# EAGLE design current_monitor_v1-2-1 (EAGLE 6.5.0)
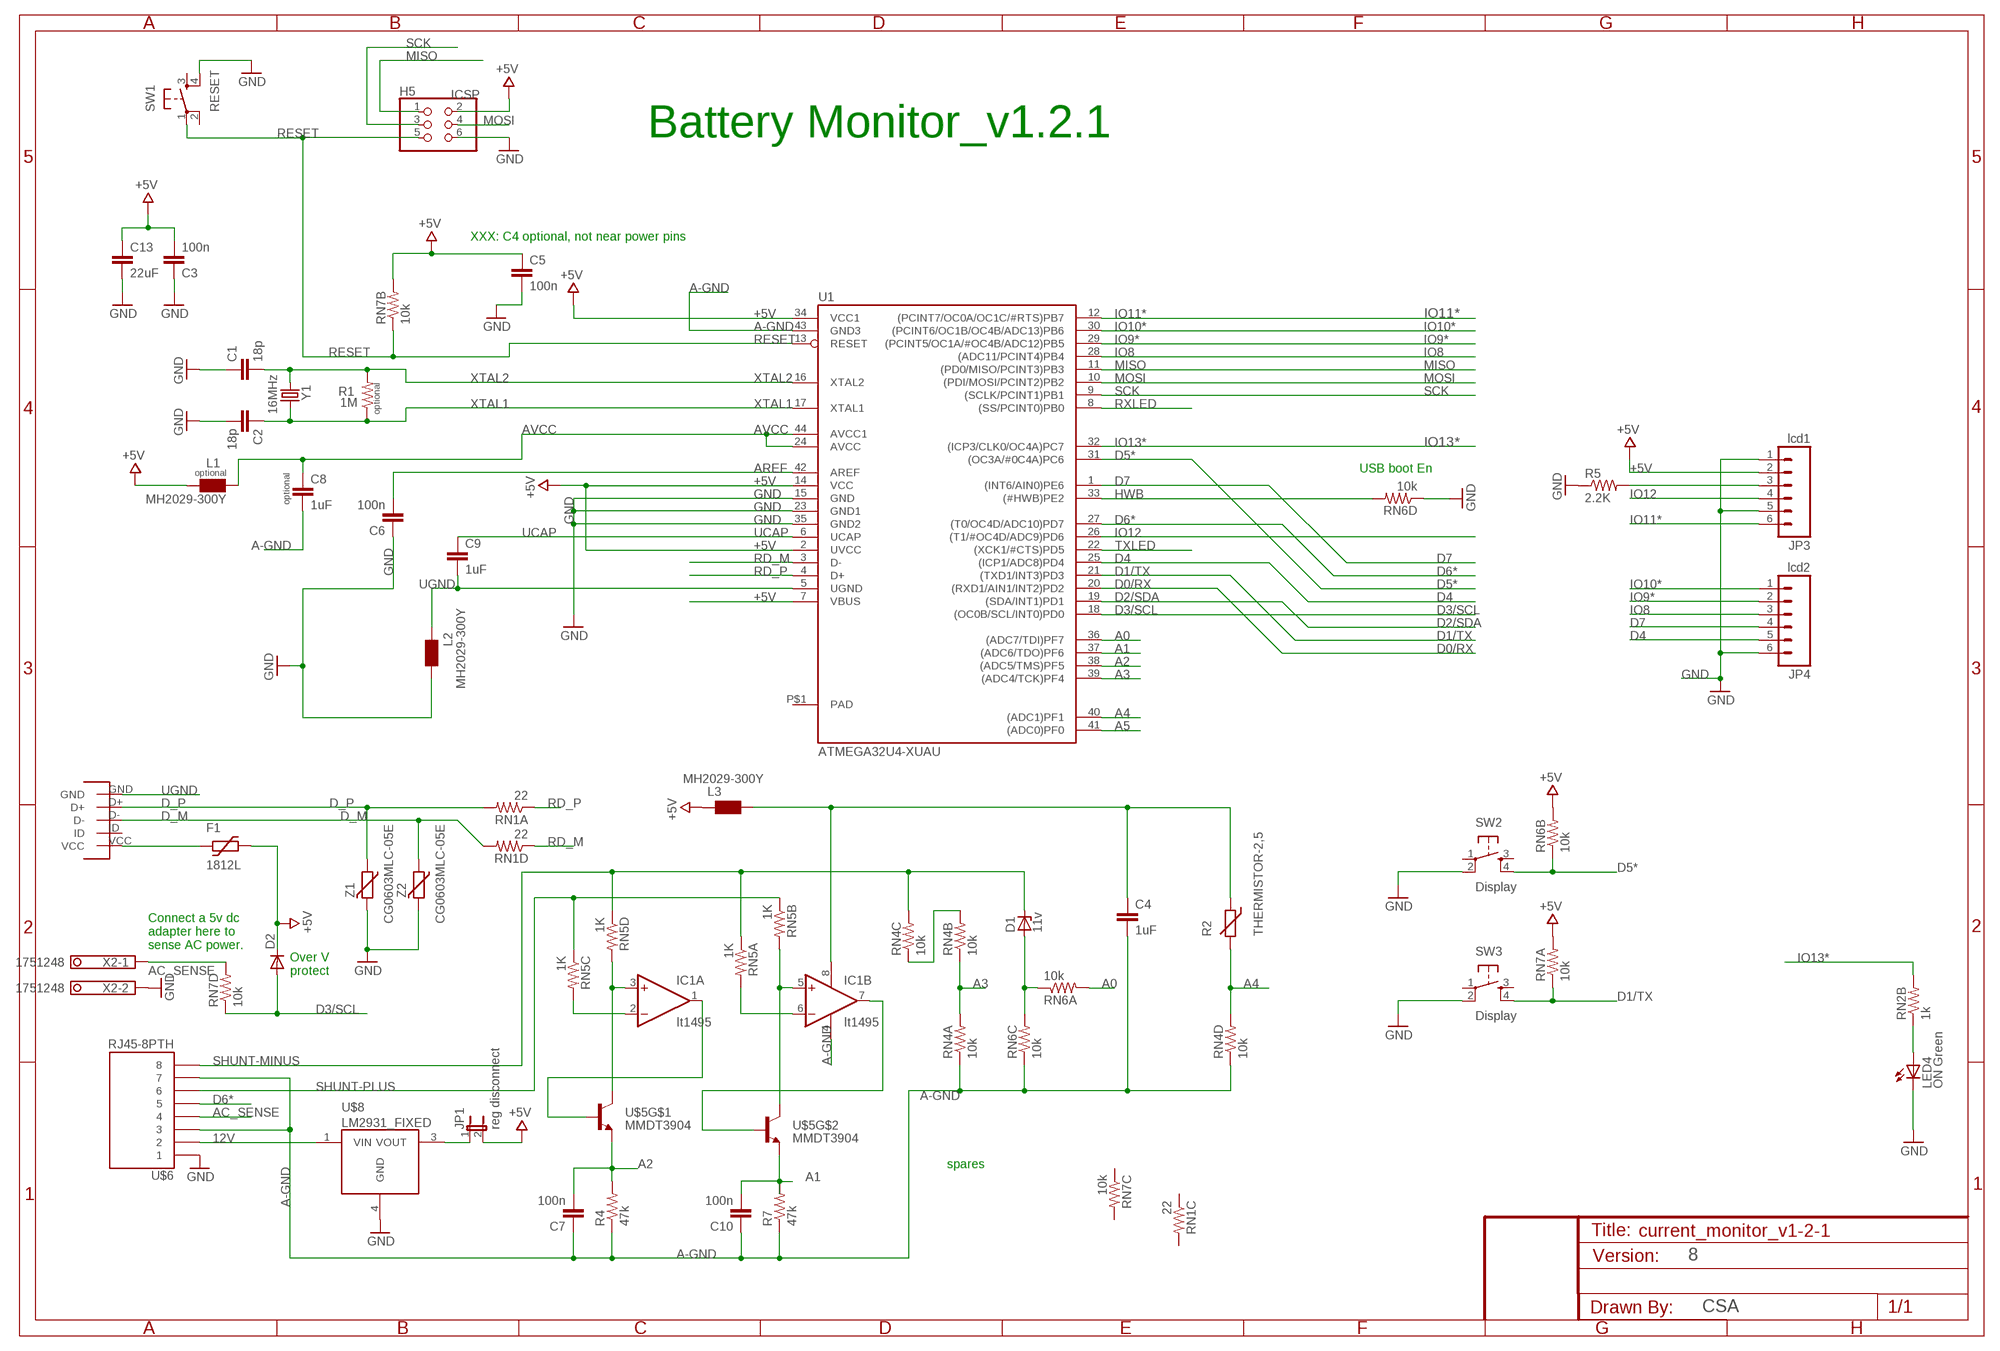
[diagram p0: schematic, sheet 1]

## Parts
C1  18p  CAP0805  [0805]
C2  18p  CAP0805  [0805]
C3  100n  CAP0805  [0805]
C4  1uF  CAP0805  [0805]
C5  100n  CAP0805  [0805]
C6  100n  CAP0805  [0805]
C7  100n  CAP0805  [0805]
C8  1uF  CAP0805  [0805]
C9  1uF  CAP0805  [0805]
C10  100n  CAP0805  [0805]
C13  22uF  CAP1206  [1206]
D1  11v  ZENER-DIODEZD-5  [ZDIO-5]
D2  DIODESMA  [SMA-DIODE]
F1  1812L  [1812L]
H5  ICSP  PINHD-2X3  [2X03]
IC1  lt1495  LM4558D  [SO08]
JP1  reg disconnect  JUMPER-2-OLDPTH_LOCK  [1X02_LOCK]
JP3  lcd1  M06FEMALE_LOCK  [1X06_FEMALE_LOCK.010]
JP4  lcd2  M06FEMALE_LOCK  [1X06_FEMALE_LOCK.010]
L1  MH2029-300Y  WE-CBF_0805  [0805]
L2  MH2029-300Y  WE-CBF_0805  [0805]
L3  MH2029-300Y  WE-CBF_0805  [0805]
LED4  ON Green  LED0805  [LED0805]
R1  1M  RESISTOR0805-RES  [0805]
R2  THERMISTOR-2,5  [RS-2,5]
R4  47k  RESISTOR0805-RES  [0805]
R5  2.2K  RESISTOR0805-RES  [0805]
R7  47k  RESISTOR0805-RES  [0805]
RN1  22  RESISTOR-ARRAYCRA06S  [CRA06S]
RN2  1k  RESISTOR-ARRAYCRA06S  [CRA06S]
RN4  10k  RESISTOR-ARRAYCRA06S  [CRA06S]
RN5  1K  RESISTOR-ARRAYCRA06S  [CRA06S]
RN6  10k  RESISTOR-ARRAYCRA06S  [CRA06S]
RN7  10k  RESISTOR-ARRAYCRA06S  [CRA06S]
SW1  RESET  TAC_SWITCHPTH  [TACTILE-PTH]
SW2  Display  TAC_SWITCHPTH  [TACTILE-PTH]
SW3  Display  TAC_SWITCHPTH  [TACTILE-PTH]
U1  ATMEGA32U4-XUAU  [TQFP44-PAD]
U$5  MMDT3904  [SOT363]
U$6  RJ45-8PTH  [RJ45-8]
U$8  LM2931_FIXED  [DPAK]
U$16  USB-MICRO-B-DIGIKEY  [USB-MICRO-B-DIGIKEY]
X2  1751248  [1751248]
Y1  16MHz  CRYSTALHC49US  [HC49US]
Z1  CG0603MLC-05E  VARISTORCN0603  [CT/CN0603]
Z2  CG0603MLC-05E  VARISTORCN0603  [CT/CN0603]

## Nets
12V: U$6.2 U$8.1(VIN)
+5V [power]: C3.2 C5.1 C13.1 D2.C F1.P$2 H5.2 JP1.2 JP3.2 L1.1 L3.1 RN6.7 RN7.7 RN7.8 U1.2(UVCC) U1.7(VBUS) U1.14(VCC) U1.34(VCC1)
A0: RN6.8 U1.36((ADC7/TDI)PF7)
A1: C10.2 R7.2 U1.37((ADC6/TDO)PF6) U$5.1(E)
A2: C7.2 R4.2 U1.38((ADC5/TMS)PF5) U$5.4(E)
A3: RN4.2 RN4.8 U1.39((ADC4/TCK)PF4)
A4: R2.2 RN4.5 U1.40((ADC1)PF1)
A5: U1.41((ADC0)PF0)
A-GND: C4.2 C7.1 C8.2 C10.1 IC1.4(P:V-) R4.1 R7.1 RN4.1 RN4.4 RN6.3 U1.43(GND3) U$6.3 U$6.7
AC_SENSE: RN7.5 U$6.4 X2.1
AREF [aref]: C6.2 U1.42(AREF)
AVCC: C8.1 L1.2 U1.24(AVCC) U1.44(AVCC1)
D0/RX: U1.20((RXD1/AIN1/INT2)PD2)
D1/TX: RN7.1 SW3.4 U1.21((TXD1/INT3)PD3)
D2/SDA: U1.19((SDA/INT1)PD1)
D3/SCL: D2.A RN7.4 U1.18((OC0B/SCL/INT0)PD0)
D4: JP4.5 U1.25((ICP1/ADC8)PD4)
D5*: RN6.2 SW2.4 U1.31((OC3A/#0C4A)PC6)
D6*: U1.27((T0/OC4D/ADC10)PD7) U$6.5
D7: JP4.4 U1.1((INT6/AIN0)PE6)
D_M: RN1.5 U$16.D- Z2.1
D_P: RN1.8 U$16.D+ Z1.1
GND: C1.1 C2.2 C3.1 C5.2 C6.1 C13.2 H5.6 JP3.1 JP3.5 JP4.6 L2.2 LED4.C R5.1 RN6.4 SW1.4 SW2.2 SW3.2 U1.15(GND) U1.23(GND1) U1.35(GND2) U$6.1 U$8.4(GND) X2.2 Z1.2 Z2.2
HWB: RN6.5 U1.33((#HWB)PE2)
IO8: JP4.3 U1.28((ADC11/PCINT4)PB4)
IO9*: JP4.2 U1.29((PCINT5/OC1A/#OC4B/ADC12)PB5)
IO10*: JP4.1 U1.30((PCINT6/OC1B/OC4B/ADC13)PB6)
IO11*: JP3.6 U1.12((PCINT7/OC0A/OC1C/#RTS)PB7)
IO12: JP3.4 U1.26((T1/#OC4D/ADC9)PD6)
IO13*: RN2.7 U1.32((ICP3/CLK0/OC4A)PC7)
LED4_ANODE: LED4.A RN2.2
MISO: H5.1 U1.11((PD0/MISO/PCINT3)PB3)
MOSI: H5.4 U1.10((PDI/MOSI/PCINT2)PB2)
N$1: IC1.5(B:+IN) RN5.7 U$5.6(C)
N$2: IC1.2(A:-IN) RN5.6
N$3: IC1.6(B:-IN) RN5.8
N$4: IC1.1(A:OUT) U$5.5(B)
N$5: IC1.7(B:OUT) U$5.2(B)
N$6: IC1.3(A:+IN) RN5.5 U$5.3(C)
N$7: F1.P$1 U$16.VCC
N$8: JP1.1 U$8.3(VOUT)
N$10: RN4.3 RN4.7
N$12: JP3.3 R5.2
N$13: D1.A RN6.1 RN6.6
N$15 [power]: C4.1 IC1.8(P:V+) L3.2 R2.1
RD_M: RN1.4 U1.3(D-)
RD_P: RN1.1 U1.4(D+)
RESET: H5.5 RN7.2 SW1.1 U1.13(RESET)
RXLED: U1.8((SS/PCINT0)PB0)
SCK: H5.3 U1.9((SCLK/PCINT1)PB1)
SHUNT-MINUS: D1.C RN4.6 RN5.1 RN5.4 U$6.8
SHUNT-PLUS: RN5.2 RN5.3 U$6.6
TXLED: U1.22((XCK1/#CTS)PD5)
UCAP: C9.1 U1.6(UCAP)
UGND [gnd]: C9.2 L2.1 U1.5(UGND) U$16.GND
XTAL1: C2.1 R1.1 U1.17(XTAL1) Y1.2
XTAL2: C1.2 R1.2 U1.16(XTAL2) Y1.1
Unconnected: RN1.2 RN1.3 RN1.6 RN1.7 RN2.1 RN2.3 RN2.4 RN2.5 RN2.6 RN2.8 RN7.3 RN7.6 SW1.2 SW1.3 SW2.1 SW2.3 SW3.1 SW3.3 U$16.ID

## Notes on the sheet
- Battery Monitor_v1.2.1
- XXX: C4 optional, not near power pins
- optional
- USB boot En
- optional
- optional
- Connect a 5v dc
  adapter here to 
  sense AC power.
- Over V
  protect
- spares
- 8
- CSA

## Power pins joined to a net without a drawn wire
PAD: U1.P$1(PAD)

## Library data of the parts
C1-C10 C13 = SparkFun-Passives:CAP: Capacitor Standard 0603 ceramic capacitor, and 0.1" leaded capacitor.
D1 = diode:ZENER-DIODE: Z-Diode
D2 = SparkFun-DiscreteSemi:DIODE: Diode These are standard reverse protection diodes and small signal diodes. SMA package can handle up to about 1A. SOD-323 can handle about 200mA. What the SOD-323 package when ordering, there are some mfgs out there that are 5-pin packages.
F1 = ptc-littlefuse:1812L
H5 = SmartPrj:PINHD-2X3: PIN HEADER
IC1 = linear:*4558: OP AMP
JP1 = SparkFun-Passives:JUMPER-2-OLD: Jumper Basic 0.1" spaced jumper. Use with breakaway headers.
JP3 JP4 = SparkFun-Connectors:M06: Header 6 Standard 6-pin 0.1" header. Use with straight break away headers (SKU : PRT-00116), right angle break away headers (PRT-00553), swiss pins (PRT-00743), machine pins (PRT-00117), and female headers (PRT-00115). Molex polarized connector foot print use with SKU : PRT-08094 with associated crimp pins and housings. NOTES ON THE VARIANTS LOCK and LOCK_LONGPADS... This footprint was designed to help hold the alignment of a through-hole component (i.e. 6-pin header) while soldering it into place. You may notice that each hole has been shifted either up or down by 0.005 of an inch from it's more standard position (which is a perfectly straight line). This slight alteration caused the pins (the squares in the middle) to touch the edges of the holes. Because they are alternating, it causes a "brace" to hold the component in place. 0.005 has proven to be the perfect amount of "off-center" position when using our standard breakaway headers. Although looks a little odd when you look at the bare footprint, once you have a header in there, the alteration is very hard to notice. Also, if you push a header all the way into place, it is covered up entirely on the bottom side. This idea of altering the position of holes to aid alignment will be further integrated into the Sparkfun Library for other footprints. It can help hold any component with 3 or more connection pins.
L1-L3 = wuerth-elektronik:WE-CBF: SMD EMI Suppression Ferrite Beads - excellent anti-EMI properties - low DCR - impedances till 3000 ohms - rated current up to 6 A
LED4 = xorduino:LED
R1 R4 R5 R7 = SparkFun-Passives:RESISTOR: Resistor Basic schematic elements and footprints for 0603, 1206, and PTH resistors.
R2 = varistor:THERMISTOR: THERMISTOR
RN1 RN2 RN4-RN7 = xorduino:RESISTOR-ARRAY
SW1-SW3 = SparkFun-Electromechanical:TAC_SWITCH: Momentary Switch Button commonly used for reset or general input. Spark Fun Electronics SKU : COM-00097
U1 = SmartPrj:ATMEGA32U4-XU
U$5 = SparkFun-DiscreteSemi:MMDT3904: Dual NPN transistor
U$6 = SparkFun-Connectors:RJ45-8: RJ45 Jack Simple RJ45, 8-pin connection - connector for common Cat5, Cat5e, and Cat6 Ethernet cables. Footprint not yet proven in production. Connector sku is PRT-00643; Breakout PCB sku is BOB-00716.
U$8 = SparkFun-PowerIC:LM2931_FIXED: LDO regulator with reverse battery protection- very durable!
U$16 = gh_stuff:USB-MICRO-B-DIGIKEY
X2 = con-phoenix-350:1751248: MKDS 1/ 2-3,5 Printklemme Nennstrom: 10 A Bemessungsspannung: 160 V Raster: 3,5 mm Polzahl: 2 Montageart: Löten Anschlussart: Schraubanschluss Anschlussrichtung vom Leiter zur Platine: 0° Source: http://eshop.phoenixcontact.com .. 1751248.pdf; OC_FARNELL: unknown; OC_NEWARK: unknown
Y1 = SparkFun-FreqCtrl:CRYSTAL: Various standard crystals. Proven footprints. Spark Fun Electronics SKU : COM-00534
Z1 Z2 = varistor:VARISTOR: VARISTOR

## Net classes
0 default: width 0.203 mm, drill 0.406 mm, clearance 0.205 mm
1 power: width 0.203 mm, drill 0.406 mm, clearance 0.205 mm to class 0, clearance 0.205 mm
2 gnd: width 0.203 mm, drill 0.406 mm, clearance 0.205 mm to class 0, clearance 0.205 mm to class 1, clearance 0.205 mm
3 usbvcc: width 0.203 mm, drill 0.406 mm, clearance 0.203 mm
4 aref: width 0.203 mm, drill 0.406 mm, clearance 0.205 mm to class 0, clearance 0.205 mm to class 1, clearance 0.205 mm to class 2, clearance 0.205 mm to class 3, clearance 0.205 mm

## Board
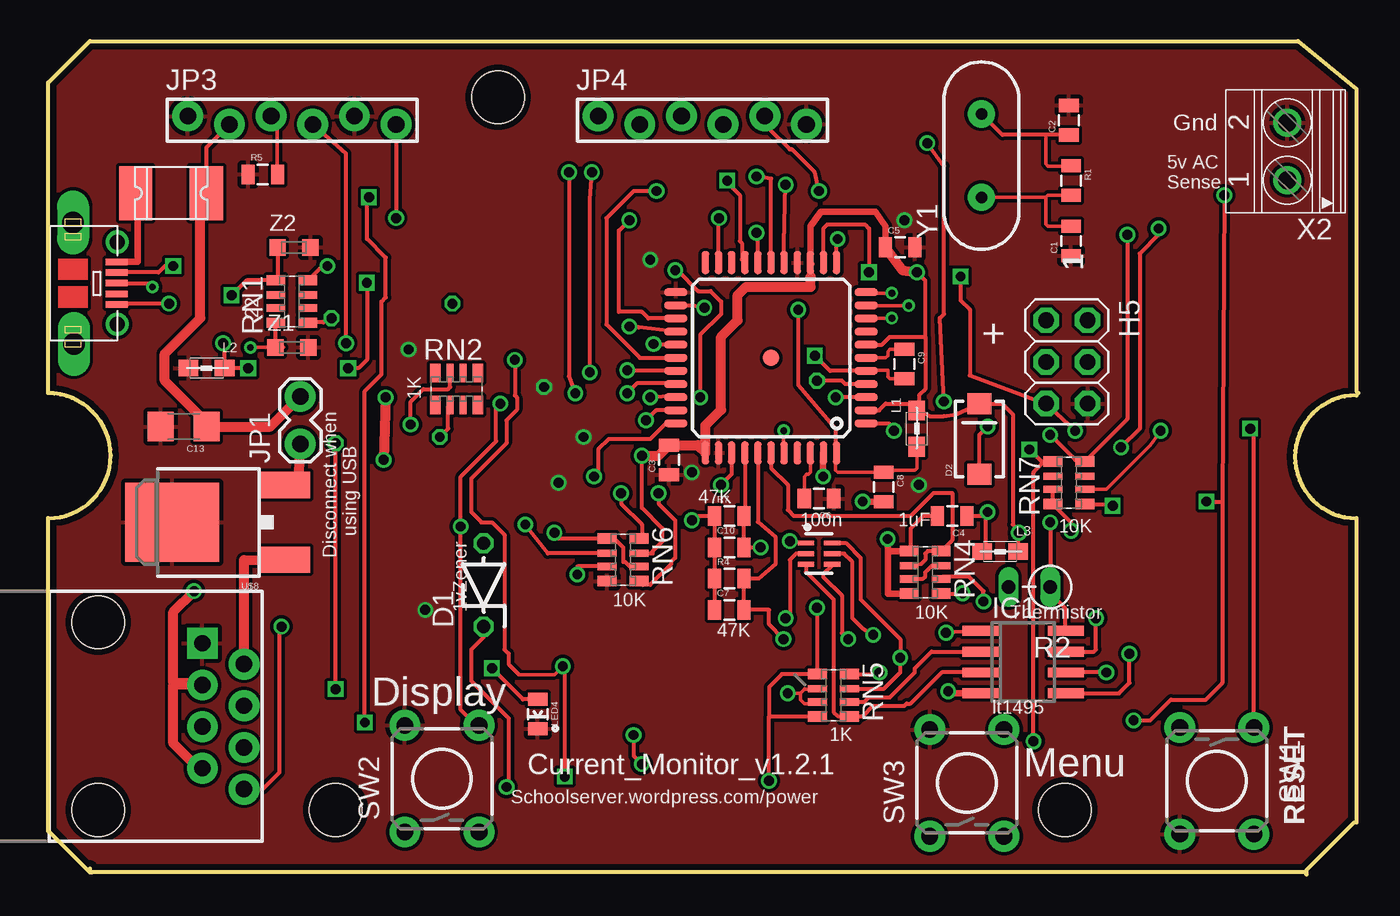
[diagram p1: board, top side]
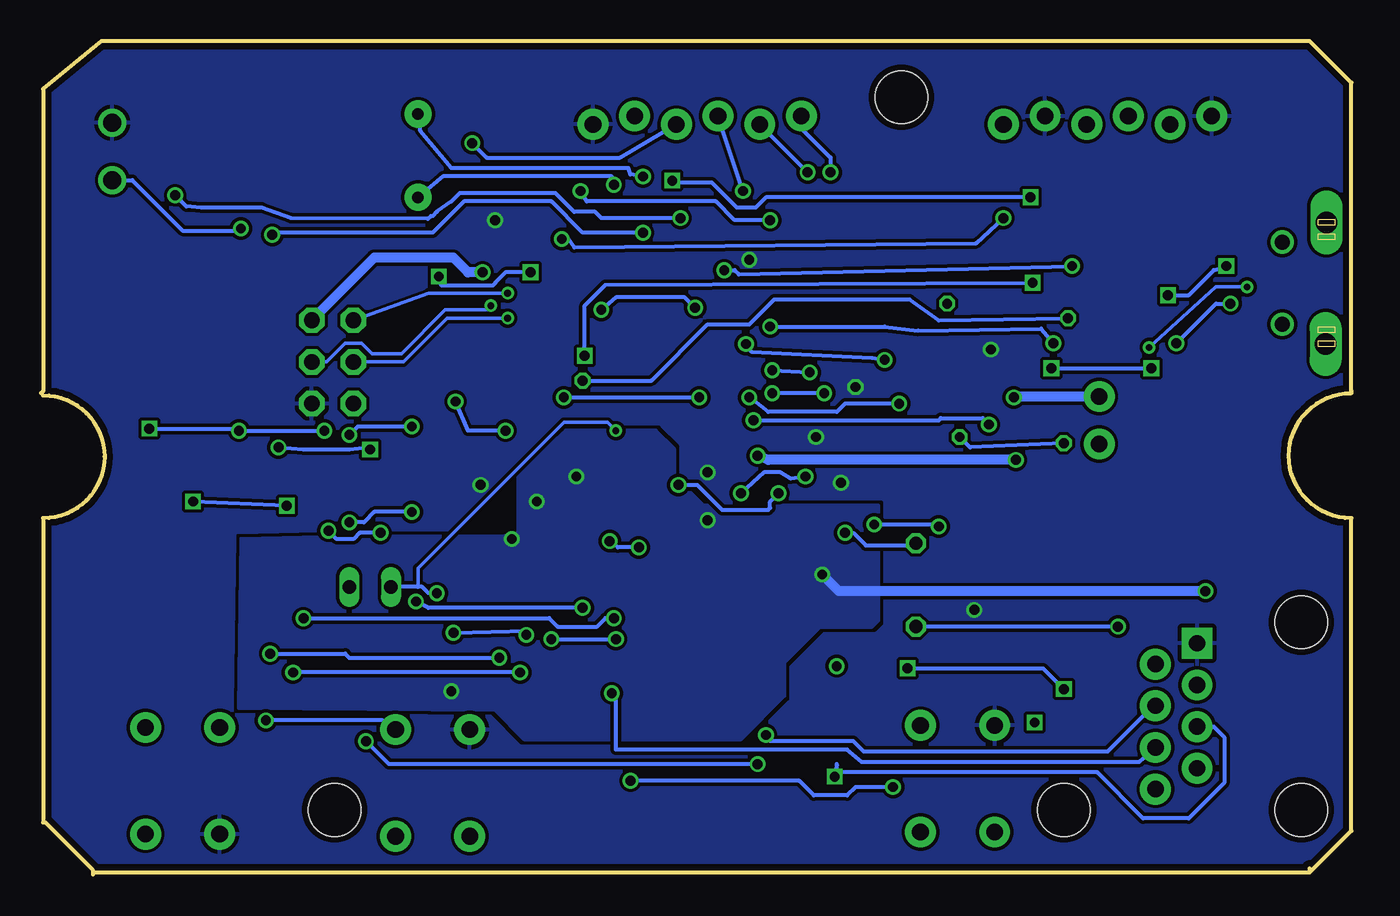
[diagram p2: board, bottom side, seen from below]

Size 79.88 x 50.8 mm. Coordinates in mm from the lower left corner, seen from the top.
Outline: 2.54,0.13 0,2.67 0,21.72 arc180 0,29.34
Outline: 0,29.46 0,48.26 2.54,50.8 76.2,50.8 79.76,47.88 79.76,29.46 79.88,29.34
Outline: 79.76,29.21 arc180 79.76,21.72 79.76,3.17
Outline: 76.71,0.13 2.67,0.13 2.54,0.25 2.54,0.38
Outline: 76.71,0 76.71,0.25 79.63,3.17
Copper layers (1*16): Top 0.0356mm / dielectric 1.5011mm / Bottom 0.0356mm
Design rules "LaenPCBOrder": minimum track width 6mil, minimum drill 13mil, track to track 6mil, track to pad 6mil, pad to pad 6mil, via to via 6mil, smd to smd 6mil, copper to edge 15mil, drill to drill 6mil, minimum pad ring 7mil, minimum via ring 7mil, stop-mask expansion 4mil, vias tented up to drill 0mil, thermal gap 10mil
Holes 3.2 mm at 61.98,3.94 27.43,47.37 17.53,3.94

### Footprints (pad centres in the part's own frame; a part is rotated, then mirrored left to right if it is on the bottom)
0805 = smd 0.8 x 1.2: 1 -0.9,0; 2 0.9,0
1206 = smd 1.6 x 1.8: 1 -1.4,0; 2 1.4,0
ZDIO-5 = drill 0.813 octagon: A 2.54,0; C -2.54,0
SMA-DIODE = smd 1.27 x 1.47: A -2.15,0; C 2.15,0
1812L = smd 2.03 x 3.3: P$1 -2.16,0; P$2 2.16,0
2X03 = drill 0.95 pad 1.55 octagon: 1 -2.54,-1.27; 2 -2.54,1.27; 3 0,-1.27; 4 0,1.27; 5 2.54,-1.27; 6 2.54,1.27
SO08 = smd 0.6 x 2.2: 1 -1.905,-2.6; 2 -0.635,-2.6; 3 0.635,-2.6; 4 1.905,-2.6; 5 1.905,2.6; 6 0.635,2.6; 7 -0.635,2.6; 8 -1.905,2.6
1X02_LOCK = drill 1.016 pad 1.88: 1 -0.178,0; 2 2.718,0
1X06_FEMALE_LOCK.010 = drill 1.016 pad 1.88: 1 0,0.254; 2 2.54,-0.254; 3 5.08,0.254; 4 7.62,-0.254; 5 10.16,0.254; 6 12.7,-0.254
0805' = smd 1.2 x 1: 1 -1.1,0; 2 1.1,0
LED0805 = smd 0.8 x 1.2: A -0.9,0; C 0.9,0
RS-2,5 = drill 0.813 long: 1 -1.27,0; 2 1.27,0
CRA06S = smd 0.63 x 1.15: 1 -1.295,-0.975; 4 1.295,-0.975; 5 1.295,0.975; 8 -1.295,0.975 | smd 0.44 x 1.15: 2 -0.4,-0.975; 3 0.4,-0.975; 6 0.4,0.975; 7 -0.4,0.975
TACTILE-PTH = drill 1.016 pad 1.88: 1 -3.251,2.261; 2 3.251,2.261; 3 -3.251,-2.261; 4 3.251,-2.261
TQFP44-PAD = smd 1.4 x 0.45: 1 -5.8,4; 2 -5.8,3.2; 3 -5.8,2.4; 4 -5.8,1.6; 5 -5.8,0.8; 6 -5.8,0; 7 -5.8,-0.8; 8 -5.8,-1.6; 9 -5.8,-2.4; 10 -5.8,-3.2; 11 -5.8,-4; 23 5.8,-4; 24 5.8,-3.2; 25 5.8,-2.4; 26 5.8,-1.6; 27 5.8,-0.8; 28 5.8,0; 29 5.8,0.8; 30 5.8,1.6; 31 5.8,2.4; 32 5.8,3.2; 33 5.8,4 | smd 0.45 x 1.4: 12 -4,-5.8; 13 -3.2,-5.8; 14 -2.4,-5.8; 15 -1.6,-5.8; 16 -0.8,-5.8; 17 0,-5.8; 18 0.8,-5.8; 19 1.6,-5.8; 20 2.4,-5.8; 21 3.2,-5.8; 22 4,-5.8; 34 4,5.8; 35 3.2,5.8; 36 2.4,5.8; 37 1.6,5.8; 38 0.8,5.8; 39 0,5.8; 40 -0.8,5.8; 41 -1.6,5.8; 42 -2.4,5.8; 43 -3.2,5.8; 44 -4,5.8 | smd 1 x 1: P$1 0,0
SOT363 = smd 0.3 x 0.99: 1 -0.65,-0.8; 2 0,-0.8; 3 0.65,-0.8; 4 0.65,0.81; 5 0,0.81; 6 -0.65,0.81
RJ45-8 = drill 1 pad 1.88 square: 1 -4.445,6.35 | drill 1 pad 1.88: 2 -3.175,8.89; 3 -1.905,6.35; 4 -0.635,8.89; 5 0.635,6.35; 6 1.905,8.89; 7 3.175,6.35; 8 4.445,8.89 | hole 3.2: -5.715,0; 5.715,0
DPAK = smd 1.6 x 3: 1 -2.28,-5.31; 3 2.28,-5.31 | smd 4.826 x 5.715: 4 0,1.588
USB-MICRO-B-DIGIKEY = smd 0.4 x 1.35: D+ 0,-0.03; D- -0.65,-0.03; GND 1.3,-0.03; ID 0.65,-0.03; VCC -1.3,-0.03 | drill 1.3 pad 1.676 long: P$1 -3.7,-2.7; P$2 3.7,-2.65 | drill 0.9 pad 1.422: P$3 -2.5,0; P$4 2.5,0
1751248 = drill 1.1 pad 1.7: 1 -1.75,-0.1; 2 1.75,-0.1
HC49US = drill 0.7 pad 1.651: 1 -2.54,0; 2 2.54,0
CT/CN0603 = smd 1 x 1: 1 -1,0; 2 1,0

### Placement (x,y rotation side)
C1  62.36,38.61 90 top
C2  62.23,45.97 90 top
C3  37.85,25.27 90 top
C4  55.12,21.84 180 top
C5  51.94,38.23 0 top
C6  46.99,22.91 180 top
C7  41.53,16.13 0 top
C8  50.93,23.62 270 top
C9  52.2,31.11 270 top
C10  41.53,19.94 0 top
C13  8.26,27.3 180 top
D1  26.54,17.65 90 top
D2  56.77,26.54 90 top
F1  7.49,41.53 0 top
H5  62.1,31.24 270 top
IC1  59.44,12.95 270 top
JP1  15.37,26.42 90 top
JP3  8.51,45.97 0 top
JP4  33.53,45.97 0 top
L1  MH2029-300Y  [0805']  52.96,27.18 270 top
L2  MH2029-300Y  [0805']  9.65,30.86 180 top
L3  MH2029-300Y  [0805']  58.04,19.68 180 top
LED4  29.84,9.78 270 top
R1  62.36,42.29 270 top
R2  59.82,17.53 180 top
R4  41.53,18.03 0 top
R5  13.08,42.67 0 top
R7  41.53,21.84 0 top
RN1  14.86,34.93 90 top
RN2  24.89,29.59 0 top
RN4  53.47,18.41 270 top
RN5  47.88,10.92 270 top
RN6  35.05,19.18 270 top
RN7  62.23,23.88 90 top
SW1  71.25,5.71 270 top
SW2  24,5.84 90 top
SW3  56.01,5.59 90 top
U1  44.07,31.5 180 top
U$5  46.99,19.56 270 top
U$6  3.05,9.65 270 top
U$8  9.14,21.46 90 top
U$16  4.21,36.04 270 top
X2  75.44,44.07 90 top
Y1  56.9,43.82 90 top
Z1  14.86,32.13 0 top
Z2  14.99,38.23 0 top

### Tracks (layer width: path | path; a pad name or v marks a point on that pad's centre or on a via)
12V
  Top 0.61: U$6.2 11.94,19.16 U$8.1
+5V  (via drill 0.6)
  Top 0.203: 46.35,37.08 46.48,37.21 U1.14
  Top 0.254: 46.48,37.31 U1.14 46.52,37.3 46.61,37.21 | 51.05,38.22 C5.1 | U1.7 50.84,32.3 51.31,32.77 53.47,32.77 | 53.47,32.77 53.47,29.59 53.09,29.21 53.09,28.4 L1.1 | JP3.2 9.65,44.32 F1.P$2 9.27,41.15 | L1.1 53.59,28.02 53.72,27.94 54.61,27.94 55.38,28.07 D2.C 58.17,28.69 58.8,28.07 58.8,21.34 v59.18,20.83 59.14,20.66 L3.1 | RN6.7 36.85,19.58 36.85,19.7 37.47,20.32 37.47,21.08 36.2,22.35 v36.2,25.53 | v62.36,20.95 62.36,21.48 RN7.8 RN7.7 | U1.2 50.65,28.3 51.05,28.7 52.53,28.7 L1.1 | 53.47,32.77 53.47,36.2 v52.96,36.7
  Top 0.305: 46.48,36.45 46.48,37.28 U1.14
  Top 0.406: C5.1 51.04,39.51 50.42,40.39 47.12,40.39 46.48,39.5 46.48,37.31
  Top 0.61: C3.2 39.59,26.17 U1.34 40.07,27.37 41.02,28.32 41.02,32.77 42.04,33.78 42.04,35.31 42.55,35.81 46.48,35.81 46.48,36.45 | 51.05,38.22 52.07,36.83 v52.96,36.7 | 9.27,41.15 9.27,33.91 7.11,31.75 7.11,30.1 9.27,27.94 C13.1 13.54,27.3 JP1.2 | v20.57,29.08 v20.45,25.27 | 37.71,26.04 C3.2 | v36.2,25.53 37.2,25.53 C3.2
  Bottom 0.254: v59.18,20.83 60.45,20.83 60.83,20.45 61.85,20.45 v62.36,20.95
  Bottom 0.61: v52.96,36.7 53.85,36.7 54.74,37.59 59.56,37.59 H5.2 | JP1.2 20.52,29.13 v20.57,29.08 | v20.45,25.27 35.56,25.27 v36.2,25.53
A0  (via drill 0.6)
  Top 0.203: 36.2,20.64 36.2,20.45 36.07,20.45 RN6.8
  Top 0.254: U1.36 41.67,24.4 v41.02,23.75 | v34.92,23.24 34.92,22.61 36.2,21.34 36.2,20.64
  Bottom 0.254: v41.02,23.75 39.88,23.75 38.35,22.22 35.56,22.22 35.43,22.35 35.43,22.73 v34.92,23.24
A1  (via drill 0.6)
  Top 0.254: R7.2 C10.2 v43.43,19.94 | R7.2 42.43,22.24 | U1.37 42.47,21.88 R7.2 | v45.21,20.32 46.17,20.19 U$5.1
  Bottom 0.254: v43.43,19.94 44.7,19.94 v45.21,20.32
A2  (via drill 0.6)
  Top 0.254: U1.38 43.27,21.5 44.32,20.57 44.32,18.92 43.31,18.03 R4.2 C7.2 43.94,16.13 43.94,15.24 v44.83,14.35 | U$5.4 47.8,18.84 47.24,18.29 47.24,18.16 48.39,17.02 48.39,14.73 v48.77,14.35
  Bottom 0.254: v48.77,14.35 v44.83,14.35
A3
  Top 0.254: RN4.2 52.51,18.8 53.21,18.92 53.47,19.18 53.47,19.56 53.62,19.71 RN4.8 55.12,20.39 55.12,23.24 53.98,23.24 52.58,21.84 45.47,21.84 45.09,22.22 45.09,23.75 44.07,24.77 U1.39
A4  (via drill 0.41, 0.6)
  Top 0.203: v44.83,27.05 44.83,25.78 U1.40
  Top 0.254: RN4.5 55.73,17.12 v55.75,17.14
  Bottom 0.203: v44.83,27.05 45.34,27.56 48.01,27.56 56.9,18.67 56.9,17.53
  Bottom 0.254: v55.75,17.14 56.26,17.14 56.64,17.53 56.9,17.53 R2.2
A-GND  (via drill 0.6)
  Top 0.254: RN6.3 32.26,18.78 v32.26,18.29 | v39.24,21.59 39.24,21.84 R7.1 C10.1 R4.1 C7.1 | C4.2 53.34,21.84 52.58,21.08 52.58,19.8 RN4.1
  Top 0.406: IC1.4 54.86,11.05 v54.86,11.18 | U1.43 47.24,25.7 v47.24,24.26 | RN4.1 51.18,19.71 v51.18,20.45 51.18,17.12 RN4.4 | C8.2 49.66,22.72 v49.66,22.73
  Top 0.61: U$6.7 9.14,6.48 7.62,8 7.62,11.56 7.75,11.68 9.27,11.68 U$6.3 7.75,11.56 7.62,11.68 7.62,16 v8.89,17.27
  Bottom 0.61: v8.89,17.27 31.24,17.27 v32.26,18.29
  pour Bottom: 28.83,22.48 39.5,22.48 41.27,24.26 41.27,25.91 42.42,27.05 47.88,27.05 50.8,24.38 50.8,20.7 51.94,20.57 61.47,20.57 67.69,20.45 67.82,10.16 52.2,10.03 50.42,8.26 37.21,8.26 34.54,10.92 34.54,12.95 32.38,15.11 29.21,15.11 28.83,15.49
AC_SENSE  (via drill 0.6)
  Top 0.254: v67.69,39.37 67.69,38.99 66.55,37.85 66.55,27.18 v65.41,26.04 | v35.69,8.51 35.69,7.24 v36.2,6.73 | v60.07,8.13 60.07,24.51 60.71,25.15 | 60.71,25.15 61.23,25.15 RN7.5 | 60.71,25.15 60.58,25.15 v59.82,25.91
  Bottom 0.254: v67.69,39.37 67.82,39.24 71.25,39.24 74.32,42.32 X2.1 | v65.41,26.04 63.88,25.91 61.09,25.91 59.94,26.04 v59.82,25.91 | U$6.4 12.06,10.29 14.86,7.49 29.72,7.49 30.35,8.13 35.43,8.13 v35.69,8.51 | v36.2,6.73 58.67,6.73 v60.07,8.13
AREF
  Top 0.203: C6.2 46.1,22.99 46.1,24.26 46.23,24.38 46.35,24.38 46.48,24.51 46.48,25.65 U1.42
AVCC  (via drill 0.6)
  Top 0.203: 49.78,24.51 48.13,24.51 48.01,24.64 48.01,25.65 U1.44 | L1.2 52.96,24.77 52.83,24.64 51.56,24.64 51.44,24.51 49.78,24.51 | 49.78,24.51 C8.1
  Top 0.254: U1.24 39.34,34.7 v40.01,34.54 | v45.72,34.42 45.72,29.84 48.01,27.18 48.01,25.76 U1.44
  Bottom 0.254: v40.01,34.54 40.64,35.18 44.83,35.18 v45.72,34.42
D1/TX  (via drill 0.6)
  Top 0.254: U1.21 40.87,39.98 v40.89,40.01 | v71.7,41.4 71.58,22.73 | 71.58,22.73 71.58,11.66 | RN7.1 64.9,22.58 v64.9,22.48 | v70.61,22.73 71.58,22.73 | 71.55,11.68 71.58,11.66 | v66.17,9.4 67.18,9.4 68.45,10.67 70.59,10.67 71.58,11.66
  Bottom 0.254: v40.89,40.01 45.72,40.01 46.1,40.39 47.37,40.39 48.51,41.53 54.36,41.53 54.86,41.02 55.75,40.39 56.01,40.13 56.11,40.13 56.29,39.95 64.64,40.01 66.42,40.64 70.1,40.64 71.02,40.72 v71.7,41.4 | v64.9,22.48 v70.61,22.73 | SW3.4 58.5,8.84 59.05,9.4 v66.17,9.4
D2/SDA  (via drill 0.6)
  Top 0.254: v19.3,9.27 19.3,29.46 20.32,30.48 20.32,34.93 20.57,35.18 20.57,37.59 19.43,38.73 19.43,41.15 v19.56,41.28 | v41.4,42.29 41.4,42.16 42.16,41.4 42.16,38.61 42.29,38.48 42.29,37.47 U1.19
  Bottom 0.254: v19.56,41.28 35.69,41.28 36.32,40.64 37.47,40.64 38.99,42.16 41.27,42.16 v41.4,42.29
D3/SCL  (via drill 0.6)
  Top 0.254: U1.18 43.27,39.08 v43.18,39.12 | v65.79,38.99 65.79,27.75 RN7.4 63.18,25.15 62.61,25.27 v61.09,26.8 | D2.A 56.77,26.8 v57.28,27.3
  Bottom 0.254: v43.18,39.12 46.86,39.12 48.77,41.02 54.1,41.02 56.01,39.12 65.66,39.12 v65.79,38.99 | v57.28,27.3 60.58,27.3 v61.09,26.8
D4  (via drill 0.6)
  Top 0.254: U1.25 36.59,33.9 36.2,34.29 34.8,34.29 34.8,39.24 v35.43,39.88 | v46.99,41.66 46.74,42.8 45.34,44.2 45.21,44.2 43.94,45.47 43.81,45.47 JP4.5
  Bottom 0.254: v35.43,39.88 37.59,39.88 38.73,41.02 46.61,41.02 v46.99,41.66
D5*  (via drill 0.6)
  Top 0.254: SW2.4 26.09,9.09 25.15,10.03 v25.15,21.21 25.15,24.26 27.3,26.42 27.3,28.45 v27.56,28.7 | v36.7,29.08 38.16,29.21 U1.31 | RN6.2 30.46,19.58 v29.08,21.34
  Bottom 0.254: v27.56,28.7 30.86,28.7 31.37,28.19 35.56,28.19 v36.7,29.08 | v29.08,21.34 25.27,21.34 v25.15,21.21
D6*  (via drill 0.6)
  Top 0.203: 28.7,12.19 30.86,12.19 v31.37,12.7
  Top 0.254: U1.27 37.12,32.3 v36.91,32.33 | 28.7,12.19 28.07,12.83 28.07,13.46 27.81,13.72 27.81,20.7 27.05,21.46 26.42,21.46 25.78,22.1 25.78,24.13 27.94,26.29 27.94,27.69 28.57,28.32 28.57,29.08 28.45,29.21 v28.45,31.37 | v31.5,5.97 31.5,12.57 v31.37,12.7
  Bottom 0.254: v36.91,32.33 36.96,32.26 36.58,31.88 29.21,31.5 v28.45,31.37 | 31.37,6.73 v31.5,5.97 31.24,6.22 15.49,6.22 12.7,3.43 9.91,3.43 7.75,5.59 7.75,8.38 8.38,9.02 U$6.5
D7  (via drill 0.6)
  Top 0.254: U1.1 51.24,27.5 v51.56,27.05 | v54.61,28.83 54.36,33.91 54.61,34.16 54.61,43.18 v53.59,44.58
  Bottom 0.254: v51.56,27.05 53.85,27.05 v54.61,28.83 | v53.59,44.58 52.7,43.69 44.58,43.69 JP4.4
D_M  (via drill 0.6)
  Top 0.254: v11.18,35.31 12.09,36.22 RN1.5 13.99,36.32 Z2.1 | v7.62,37.08 7.11,37.08 6.73,36.7 4.81,36.7 4.81,36.69 U$16.D-
  Bottom 0.254: v11.18,35.31 9.91,35.31 8.38,36.83 v7.62,37.08
D_P  (via drill 0.41)
  Top 0.203: 14.35,32.13 Z1.1 v12.32,32.13
  Top 0.254: Z1.1 13.86,33.61 RN1.8 | U$16.D+ 6.35,36.04 v6.35,35.81
  Bottom 0.203: v6.35,35.81 8.26,35.81 v12.32,32.13
GND  (via drill 0.6)
  other vias: 21.97,32 32.64,26.67 31.11,23.88 22.99,16.13 52.2,39.88 39.24,24.51 36.7,37.47 30.23,29.72 53.09,23.75
  pour Bottom (rank 6): -0.38,48.01 -0.13,48.01 2.54,50.67 76.96,50.67 79.63,48.01 79.63,2.79 76.96,0.13 2.54,0.13 -0.13,2.79 -0.13,47.75
  pour Top: 2.79,0.38 2.67,0.38 0.13,2.92 0.13,48.01 2.79,50.67 76.58,50.67 79.63,47.62 79.63,2.92 76.83,0.13 3.05,0.13
HWB  (via drill 0.6)
  Top 0.254: U1.33 37.66,27.5 36.7,26.54 34.16,26.54 33.53,25.91 33.53,24.26 v33.27,24.26 | v37.21,23.24 37.21,22.61 38.23,21.59 38.23,19.3 37.97,19.05 37.97,18.92 36.7,17.65 36.26,17.65 RN6.5
  Bottom 0.254: v33.27,24.26 34.16,24.13 34.8,24.51 35.81,24.51 v37.21,23.24
IO8  (via drill 0.6)
  Top 0.254: v37.08,41.66 35.69,41.66 34.04,40.01 34.04,33.53 36.07,31.5 U1.28
  Bottom 0.254: v37.08,41.66 JP4.3
IO9*  (via drill 0.6)
  Top 0.254: U1.29 35.34,30.7 v35.31,30.73 | v33.02,30.61 33.02,41.15 v33.15,42.8
  Bottom 0.254: v35.31,30.73 v33.02,30.61 | JP4.2 v33.15,42.8
IO10*  (via drill 0.6)
  Top 0.203: 38.35,29.84 U1.30
  Top 0.254: v31.75,42.8 31.75,30.35 v32.13,29.34 | v35.31,29.34 35.94,29.97 38.19,29.97 U1.30 | 38.35,29.84 38.23,29.97
  Bottom 0.254: v31.75,42.8 31.75,43.69 33.53,45.47 JP4.1 | v32.13,29.34 v35.31,29.34
IO11*  (via drill 0.6)
  Top 0.254: U1.12 48.07,38.67 v48.13,38.73 | JP3.6 v21.21,40.01
  Bottom 0.254: v48.13,38.73 47.75,38.73 47.37,38.23 22.86,38.48 v21.21,40.01
IO12  (via drill 0.6)
  Top 0.254: U1.26 36.02,33.35 v35.43,33.4 | v18.16,32.39 18.16,43.94 JP3.4
  Bottom 0.254: v35.43,33.4 28.45,33.4 26.42,33.15 18.92,33.27 v18.16,32.39
IO13*  (via drill 0.6)
  Top 0.254: U1.32 37.06,28.3 v36.45,27.69 | v22.1,27.43 22.1,28.83 22.86,29.59 24.38,29.59 24.51,29.72 24.51,30.55 RN2.7
  Bottom 0.254: v36.45,27.69 25.15,27.69 25.02,27.81 22.48,27.81 v22.1,27.43
LED4_ANODE  (via drill 0.6)
  Top 0.254: 17.65,26.16 v17.53,26.29 v17.53,11.3 | v23.88,26.67 24.38,27.18 24.38,28.51 RN2.2 | LED4.A 28.95,10.68 v27.05,12.57
  Bottom 0.254: v17.53,26.29 23.24,26.04 v23.88,26.67 | v27.05,12.57 18.8,12.57 v17.53,11.3
MISO  (via drill 0.41)
  Top 0.203: v51.44,35.43 49.91,35.43 U1.11
  Bottom 0.203: v51.44,35.43 56.26,35.43 H5.1
MOSI  (via drill 0.41)
  Top 0.203: v52.45,34.67 49.91,34.67 U1.10
  Bottom 0.203: H5.4 62.48,31.24 61.34,32.39 60.33,32.39 59.69,31.75 57.91,31.75 55.24,34.42 52.7,34.42 v52.45,34.67
N$1  (via drill 0.6)
  Top 0.254: IC1.5 65.28,11.05 65.91,11.68 v65.91,13.46 | U$5.6 48.63,20.21 49.53,19.3 49.53,16.76 51.94,14.35 v51.94,13.21 51.94,12.32 50.95,11.32 RN5.7
  Bottom 0.254: v65.91,13.46 61.34,13.46 61.09,13.21 v51.94,13.21
N$2
  Top 0.254: IC1.2 53.85,13.59 52.83,12.57 52.83,12.32 51.31,10.79 50.04,10.79 49.77,10.52 RN5.6
N$3  (via drill 0.6)
  Top 0.254: RN5.8 50.57,12.22 v50.67,12.32 | v64.52,12.32 IC1.6
  Bottom 0.254: v50.67,12.32 v64.52,12.32
N$4  (via drill 0.6)
  Top 0.254: IC1.1 v54.74,14.73 | v50.29,14.61 49.66,14.99 49.02,15.62 49.02,19.05 48.51,19.56 U$5.5
  Bottom 0.254: v54.74,14.73 50.16,14.86 v50.29,14.61
N$5  (via drill 0.6)
  Top 0.254: IC1.7 63.75,13.59 63.88,13.72 v63.88,15.62 | U$5.2 45.59,19.56 45.21,19.18 45.21,15.88 v44.96,15.62
  Bottom 0.254: v63.88,15.62 48.9,15.62 48.39,15.11 45.97,15.11 45.47,15.62 v44.96,15.62
N$6
  Top 0.254: IC1.3 54.48,12.32 52.58,10.41 52.32,10.41 52.2,10.29 50.29,10.29 49.66,9.65 48.88,9.65 RN5.5 48.83,9.65 48.13,9.65 47.88,9.91 47.88,16.76 46.19,18.45 U$5.3
N$7
  Top 0.406: U$16.VCC 5.46,37.34 5.46,40.51 5.33,40.51 F1.P$1
N$8
  Top 0.61: U$8.3 15.29,24.38 JP1.1
N$10
  Top 0.254: RN4.7 53.87,18.81 53.47,18.41 53.47,18.16 53.34,18.03 52.51,18.03 RN4.3
N$12
  Top 0.203: JP3.3 13.97,45.85 R5.2
N$13  (via drill 0.6)
  Top 0.254: v30.86,20.83 30.84,20.47 RN6.1 34.52,20.47 35.05,19.94 35.05,19.05 35.18,19.05 35.43,18.8 36.01,18.8 RN6.6
  Bottom 0.254: v30.86,20.83 30.35,20.83 29.59,20.07 26.67,20.07 D1.A
N$15  (via drill 0.6)
  Top 0.254: 57.02,19.68 L3.2 57.15,19.9 57.15,21.83 | 57.15,21.83 C4.1 | 57.15,21.83 57.15,21.84 | 57.15,21.83 v57.28,22.1 | v61.09,21.46 R2.1 61.09,17.14 61.98,16.26 61.98,14.92 IC1.8
  Bottom 0.254: v57.28,22.1 59.56,22.1 60.2,21.46 v61.09,21.46
N$24  (via drill 0.6)
  other vias: 24.64,34.8
RD_M  (via drill 0.6)
  Top 0.254: U1.3 v48.02,29.1 v48.01,29.08 | v17.02,37.08 16.7,37.08 RN1.4 | v38.23,36.83 38.35,36.83 39.62,35.56 40.39,35.56 41.02,34.93 41.02,34.16 39.75,32.89 v39.75,29.08
  Bottom 0.254: v48.01,29.08 v39.75,29.08 | v38.23,36.83 37.59,36.83 37.34,36.58 v17.02,37.08
RD_P  (via drill 0.6)
  Top 0.254: U1.4 48.59,29.9 48.39,30.1 v46.86,30.1 | v17.27,33.91 17.02,33.91 16.76,33.66 15.86,33.66 RN1.1
  Bottom 0.254: v46.86,30.1 42.67,30.1 39.24,33.53 36.7,33.53 35.18,35.05 26.92,35.05 25.15,33.78 v17.27,33.91
RESET  (via drill 0.6)
  Top 0.203: v67.82,27.05 67.18,26.16 64.52,23.49 63.25,23.49 RN7.2
  Top 0.254: U1.13 47.27,39.4 47.5,39.62 49.78,39.62 50.04,39.37 v50.04,36.7 | v55.63,36.45 55.63,35 56.19,34.44 56.19,30.43 H5.5 61.09,28.45 v62.61,27.05 | SW1.1 73.51,26.95 v73.28,27.18
  Bottom 0.254: v50.04,36.7 51.56,36.7 52.2,36.07 52.2,36.04 52.35,35.89 55.45,35.89 v55.63,36.45 | v62.61,27.05 v67.82,27.05 67.94,27.18 v73.28,27.18
SCK  (via drill 0.41)
  Top 0.203: v51.44,33.91 49.91,33.91 U1.9
  Bottom 0.203: v51.44,33.91 55.12,33.91 57.78,31.24 H5.3
SHUNT-MINUS  (via drill 0.6)
  Top 0.254: U$6.8 13.08,5.21 14.1,6.22 14.1,14.99 v14.22,15.11 | D1.C 26.54,14.48 25.78,13.72 25.78,11.81 28.07,9.53 28.07,5.46 v27.94,5.33 | 43.94,9.65 43.94,11.43 44.73,12.22 RN5.1 46.9,16.21 v46.86,16.26 | 43.94,9.65 46.88,9.65 RN5.4 | v43.94,5.71 43.94,9.65 | v57.02,16.64 57.02,17.27 56.13,18.16 54.55,18.16 RN4.6
  Bottom 0.254: v14.22,15.11 D1.C | v27.94,5.33 30.23,5.33 30.73,4.83 32.77,4.83 33.66,5.71 v43.94,5.71 | v46.86,16.26 56.26,16.26 v57.02,16.64
SHUNT-PLUS  (via drill 0.6)
  Top 0.203: 46.12,11.32 46.1,11.3 | 46.1,11.3 45.85,11.05 | 45.85,11.05 45.85,10.67 46.1,10.41 46.86,10.41 RN5.3 | v45.09,11.05 45.85,11.05 | 46.1,11.3 46.86,11.3 RN5.2
  Bottom 0.254: U$6.6 12.95,6.86 29.84,6.86 30.73,7.62 44.83,7.62 44.83,10.79 v45.09,11.05
UCAP
  Top 0.203: U1.6 51.05,31.5 51.18,31.62 51.18,31.88 51.31,32 52.7,32 C9.1
UGND  (via drill 0.6)
  Top 0.203: C9.2 52.7,30.23 51.31,30.23 51.18,30.35 51.18,30.73 49.91,30.73 U1.5
  Top 0.254: v10.67,32.39 10.75,32.3 L2.1 v12.19,30.86 | v7.37,34.8 4.83,34.8 4.83,34.74 U$16.GND | U1.5 47.66,30.7 v46.74,31.62 | v19.43,36.07 19.43,31.37 18.92,30.86 v18.29,30.86
  Bottom 0.254: v10.67,32.39 8.26,34.8 v7.37,34.8 | v46.74,31.62 46.74,34.67 45.47,35.94 v19.43,36.07 | v18.29,30.86 v12.19,30.86
XTAL1  (via drill 0.6)
  Top 0.203: 60.83,45.07 60.83,43.31 60.96,43.18 R1.1
  Top 0.254: U1.17 44.07,42.42 v43.18,42.55 | C2.1 60.83,45.07 58.18,45.07 Y1.2
  Bottom 0.254: v43.18,42.55 43.94,42.67 44.07,43.05 54.86,43.05 56.77,45.34 56.77,46.23 Y1.2
XTAL2  (via drill 0.6)
  Top 0.203: 60.83,41.28 60.83,39.62 60.96,39.5 C1.2 | 60.83,41.28 60.96,41.4 62.36,41.4 R1.2 | Y1.1 60.83,41.28
  Top 0.254: U1.16 44.83,37.3 v44.96,42.04
  Bottom 0.254: v44.96,42.04 45.09,42.55 55.37,42.55 Y1.1

### Text on the board
tPlace: Gnd | 5v AC / Sense | 1 | 22 | + | 1K | 47K | 100n | 1uF | 10K | Disconnect when / using USB | 10K | 1vZener | 10K | Thermistor | 47K | Display | lt1495 | 1K | Current_Monitor_v1.2.1 | Menu | Schoolserver.wordpress.com/power | RESET
tValues: To Battery